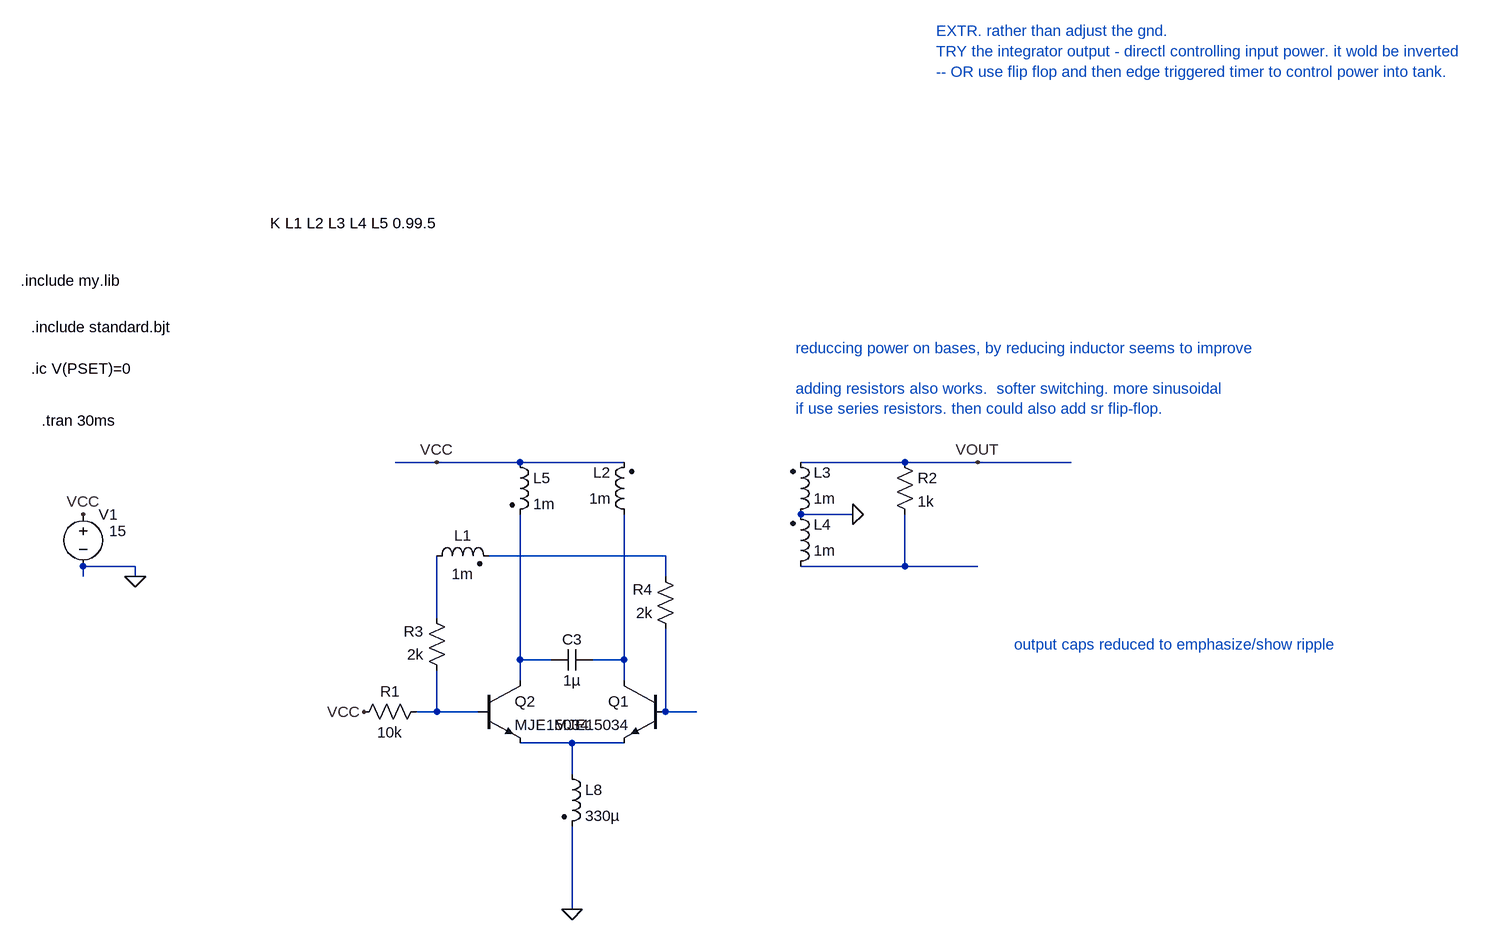
[diagram p0: schematic Draft16.asc]
Draft16.asc, the LTspice schematic file:
Version 4
SHEET 1 5720 1740
WIRE 1376 -128 1312 -128
WIRE 1504 -128 1376 -128
WIRE 1664 -128 1504 -128
WIRE 2096 -128 1936 -128
WIRE 2208 -128 2096 -128
WIRE 2352 -128 2208 -128
WIRE 2016 -48 1936 -48
WIRE 1728 16 1456 16
WIRE 912 32 832 32
WIRE 2096 32 2096 -48
WIRE 2096 32 1936 32
WIRE 2208 32 2096 32
WIRE 832 48 832 32
WIRE 912 48 912 32
WIRE 1728 48 1728 16
WIRE 1376 112 1376 16
WIRE 1504 176 1504 -48
WIRE 1552 176 1504 176
WIRE 1664 176 1664 -48
WIRE 1664 176 1616 176
WIRE 1504 208 1504 176
WIRE 1664 208 1664 176
WIRE 1376 256 1376 192
WIRE 1376 256 1344 256
WIRE 1440 256 1376 256
WIRE 1728 256 1728 128
WIRE 1776 256 1728 256
WIRE 1584 304 1504 304
WIRE 1664 304 1584 304
WIRE 1584 352 1584 304
WIRE 1584 560 1584 432
FLAG 2016 -48 0
FLAG 912 48 0
FLAG 832 -48 VCC
FLAG 1376 -128 VCC
FLAG 1264 256 VCC
FLAG 1584 560 0
FLAG 2208 -128 VOUT
SYMBOL ind2 1920 -32 M180
WINDOW 0 36 80 Left 2
WINDOW 3 36 40 Left 2
SYMATTR InstName L3
SYMATTR Value 1m
SYMATTR Type ind
SYMBOL ind2 1680 -32 R180
WINDOW 0 36 80 Left 2
WINDOW 3 36 40 Left 2
SYMATTR InstName L2
SYMATTR Value 1m
SYMATTR Type ind
SYMBOL ind2 1920 48 M180
WINDOW 0 36 80 Left 2
WINDOW 3 36 40 Left 2
SYMATTR InstName L4
SYMATTR Value 1m
SYMATTR Type ind
SYMBOL voltage 832 -64 R0
WINDOW 123 0 0 Left 0
WINDOW 39 0 0 Left 0
WINDOW 3 40 42 Left 2
SYMATTR Value 15
SYMATTR InstName V1
SYMBOL ind2 1360 32 R270
WINDOW 0 32 56 VTop 2
WINDOW 3 4 56 VBottom 2
SYMATTR InstName L1
SYMATTR Value 1m
SYMATTR Type ind
SYMBOL ind2 1488 -144 R0
SYMATTR InstName L5
SYMATTR Value 1m
SYMATTR Type ind
SYMBOL ind2 1568 336 R0
SYMATTR InstName L8
SYMATTR Value 330µ
SYMATTR Type ind
SYMBOL cap 1616 160 R90
WINDOW 0 0 32 VBottom 2
WINDOW 3 32 32 VTop 2
SYMATTR InstName C3
SYMATTR Value 1µ
SYMBOL res 1360 240 R90
WINDOW 0 0 56 VBottom 2
WINDOW 3 32 56 VTop 2
SYMATTR InstName R1
SYMATTR Value 10k
SYMBOL npn 1440 208 R0
SYMATTR InstName Q2
SYMATTR Value MJE15034
SYMBOL npn 1728 208 M0
SYMATTR InstName Q1
SYMATTR Value MJE15034
SYMBOL res 2080 -144 R0
SYMATTR InstName R2
SYMATTR Value 1k
SYMBOL res 1392 208 R180
WINDOW 0 36 76 Left 2
WINDOW 3 36 40 Left 2
SYMATTR InstName R3
SYMATTR Value 2k
SYMBOL res 1744 144 R180
WINDOW 0 36 76 Left 2
WINDOW 3 36 40 Left 2
SYMATTR InstName R4
SYMATTR Value 2k
TEXT 768 -192 Left 2 !.tran 30ms
TEXT 1120 -496 Left 2 !K L1 L2 L3 L4 L5 0.99.5
TEXT 752 -336 Left 2 !.include standard.bjt
TEXT 736 -408 Left 2 !.include my.lib
TEXT 2264 152 Left 2 ;output caps reduced to emphasize/show ripple
TEXT 752 -272 Left 2 !.ic V(PSET)=0
TEXT 2144 -792 Left 2 ;EXTR. rather than adjust the gnd.\nTRY the integrator output - directl controlling input power. it wold be inverted\n-- OR use flip flop and then edge triggered timer to control power into tank.
TEXT 1928 -304 Left 2 ;reduccing power on bases, by reducing inductor seems to improve\n \nadding resistors also works.  softer switching. more sinusoidal\nif use series resistors. then could also add sr flip-flop.

The netlist it stands for:
* Draft16.asc
L3 0 VOUT 1m
L2 N005 VCC 1m
L4 N002 0 1m
V1 VCC 0 15
L1 N003 N001 1m
L5 VCC N004 1m
L8 N008 0 330µ
C3 N005 N004 1µ
R1 N006 VCC 10k
Q2 N004 N006 N008 0 MJE15034
Q1 N005 N007 N008 0 MJE15034
R2 VOUT N002 1k
R3 N006 N003 2k
R4 N007 N001 2k
.model NPN NPN
.model PNP PNP
.lib standard.bjt
.tran 30ms
K L1 L2 L3 L4 L5 0.99.5
.include standard.bjt
.include my.lib
* output caps reduced to emphasize/show ripple
.ic V(PSET)=0
* EXTR. rather than adjust the gnd.
* TRY the integrator output - directl controlling input power. it wold be inverted
* -- OR use flip flop and then edge triggered timer to control power into tank.
* reduccing power on bases, by reducing inductor seems to improve
* adding resistors also works.  softer switching. more sinusoidal
* if use series resistors. then could also add sr flip-flop.
.backanno
.end